# EasyEDA schematic 1-Schematic_ProjectPCB.json
TITLE: Sheet_1; REV: 1.0; Date: 2020-05-28; Sheet: 1/1; Drawn By: shainechristmas; Company: Your Company
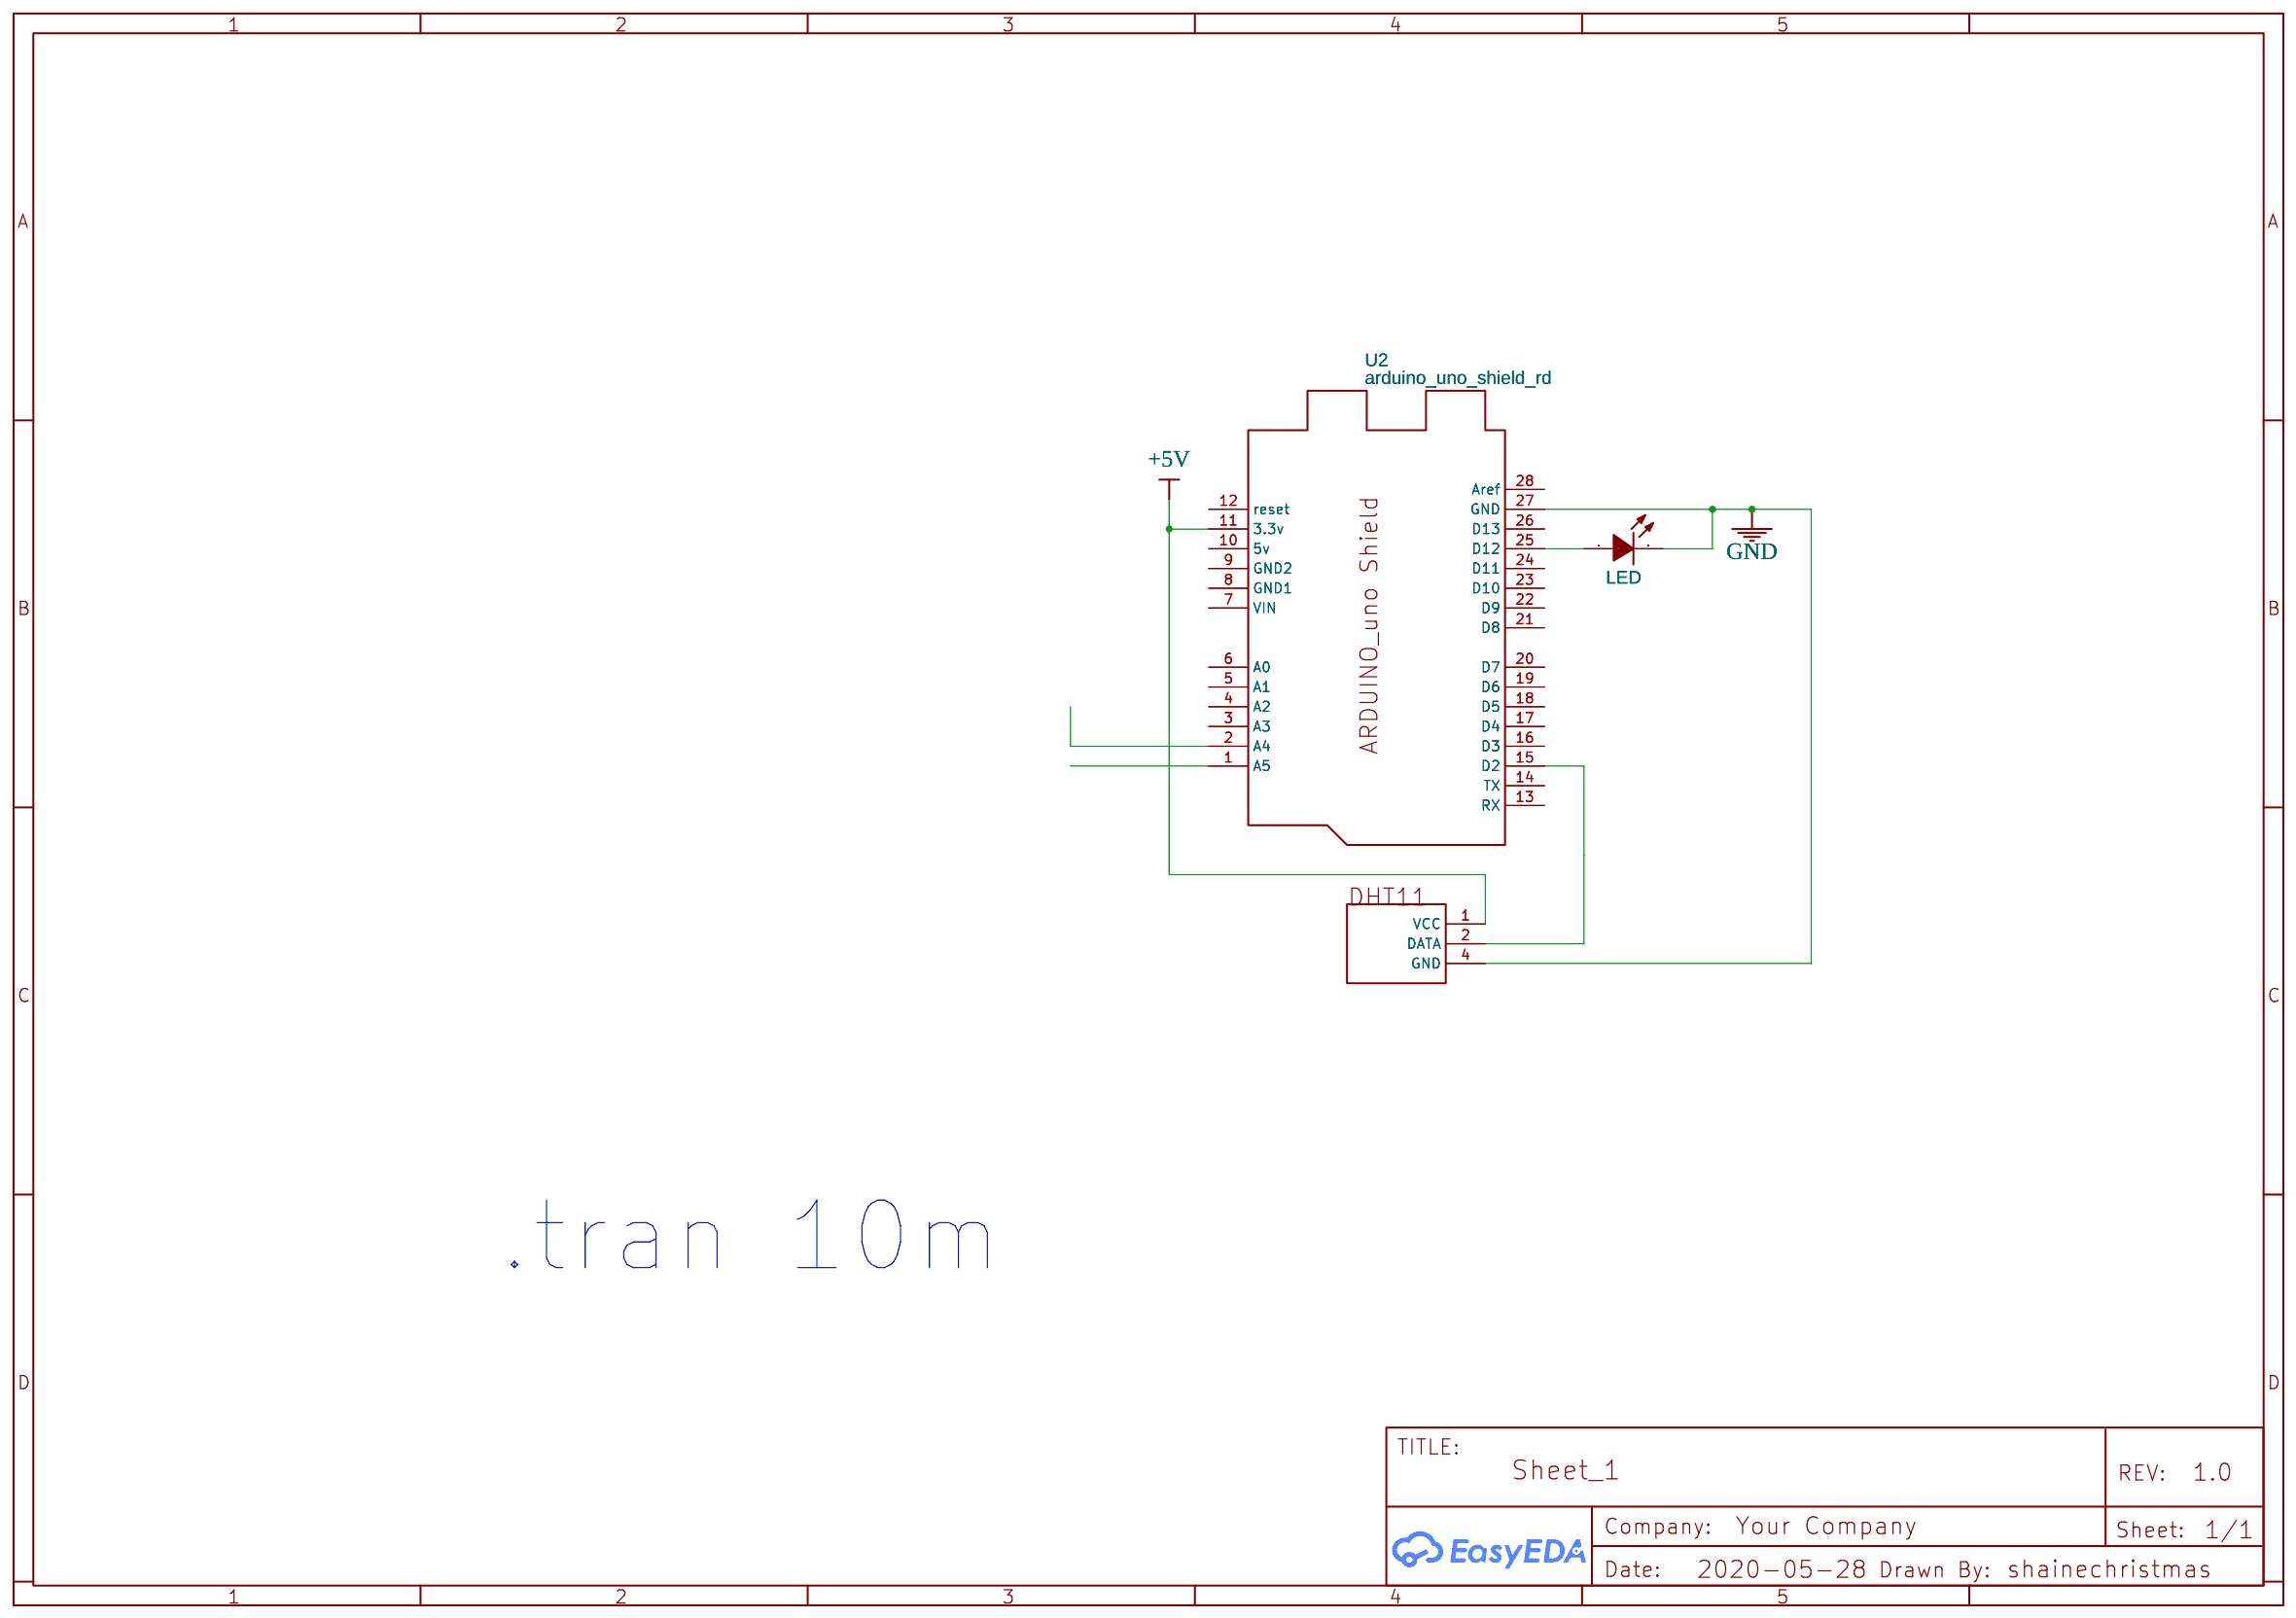
[diagram p0: schematic sheet]

## Parts
D1  LED  [LED3MM]
U2  arduino_uno_shield_rd  [ARDUINOUNOSHIELD_RD PCB LIB]
U3  DHT11 COPY  [SENSOR-TH_DHT11]

## Library data of the parts
D1 = LED
U2 = arduino_uno_shield_rd: Contributor: emiliogallard
U3 = DHT11 COPY: catid: 20; Contributor: PingWin00; sim: true

## Nets
+5V: U2.11(3.3v) U3.1(VCC)
GND: D1.2(K) U2.27(GND) U3.4(GND)
Net-(D1-1): D1.1(A) U2.25(D12)
Net-(U2-15): U2.15(D2) U3.2(DATA)

Not connected (* = marked no-connect by the designer): U2 1(A5) 2(A4) 3(A3) 4(A2) 5(A1) 6(A0) 7(VIN) 8(GND1) 9(GND2) 10(5v) 12(reset) 13(RX) 14(TX) 16(D3) 17(D4) 18(D5) 19(D6) 20(D7) 21(D8) 22(D9) 23(D10) 24(D11) 26(D13) 28(Aref)

## Notes on the sheet
- .tran 10m
